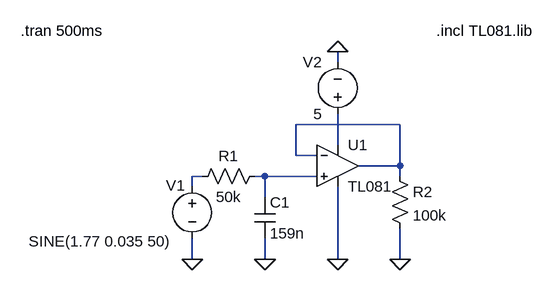
[diagram p0: schematic _Lowpass_Noninverting_TL081.asc]
_Lowpass_Noninverting_TL081.asc, the LTspice schematic file:
Version 4
SHEET 1 1944 680
WIRE 1312 64 1312 48
WIRE 1408 160 1248 160
WIRE 1312 192 1312 144
WIRE 1248 208 1248 160
WIRE 1280 208 1248 208
WIRE 1408 224 1408 160
WIRE 1408 224 1344 224
WIRE 1104 240 1088 240
WIRE 1200 240 1184 240
WIRE 1280 240 1200 240
WIRE 1408 240 1408 224
WIRE 1088 256 1088 240
WIRE 1200 272 1200 240
WIRE 1088 368 1088 336
WIRE 1200 368 1200 336
WIRE 1312 368 1312 256
WIRE 1408 368 1408 320
FLAG 1312 368 0
FLAG 1408 368 0
FLAG 1088 368 0
FLAG 1312 48 0
FLAG 1200 368 0
SYMBOL Opamps\\opamp2 1312 160 R0
SYMATTR InstName U1
SYMATTR Value TL081
SYMBOL res 1200 224 R90
WINDOW 0 0 56 VBottom 2
WINDOW 3 32 56 VTop 2
SYMATTR InstName R1
SYMATTR Value 50k
SYMBOL res 1392 224 R0
SYMATTR InstName R2
SYMATTR Value 100k
SYMBOL voltage 1088 240 R0
WINDOW 3 -252 100 Left 2
WINDOW 123 24 72 Left 2
WINDOW 39 0 0 Left 0
WINDOW 0 -40 14 Left 2
SYMATTR Value SINE(1.77 0.035 50)
SYMATTR InstName V1
SYMBOL voltage 1312 160 R180
WINDOW 0 24 96 Left 2
WINDOW 3 24 16 Left 2
WINDOW 123 0 0 Left 0
WINDOW 39 0 0 Left 0
SYMATTR InstName V2
SYMATTR Value 5
SYMBOL cap 1184 272 R0
SYMATTR InstName C1
SYMATTR Value 159n
TEXT 824 16 Left 2 !.tran 500ms
TEXT 1464 16 Left 2 !.incl TL081.lib

The netlist it stands for:
* _Lowpass_Noninverting_TL081.asc
XU1 N004 N001 N002 0 N001 TL081  ; pins In+ In- V+ V- OUT
R1 N004 N003 50k
R2 N001 0 100k
V1 N003 0 SINE(1.77 0.035 50)
V2 N002 0 5
C1 N004 0 159n
.tran 500ms
.incl TL081.lib
.backanno
.end